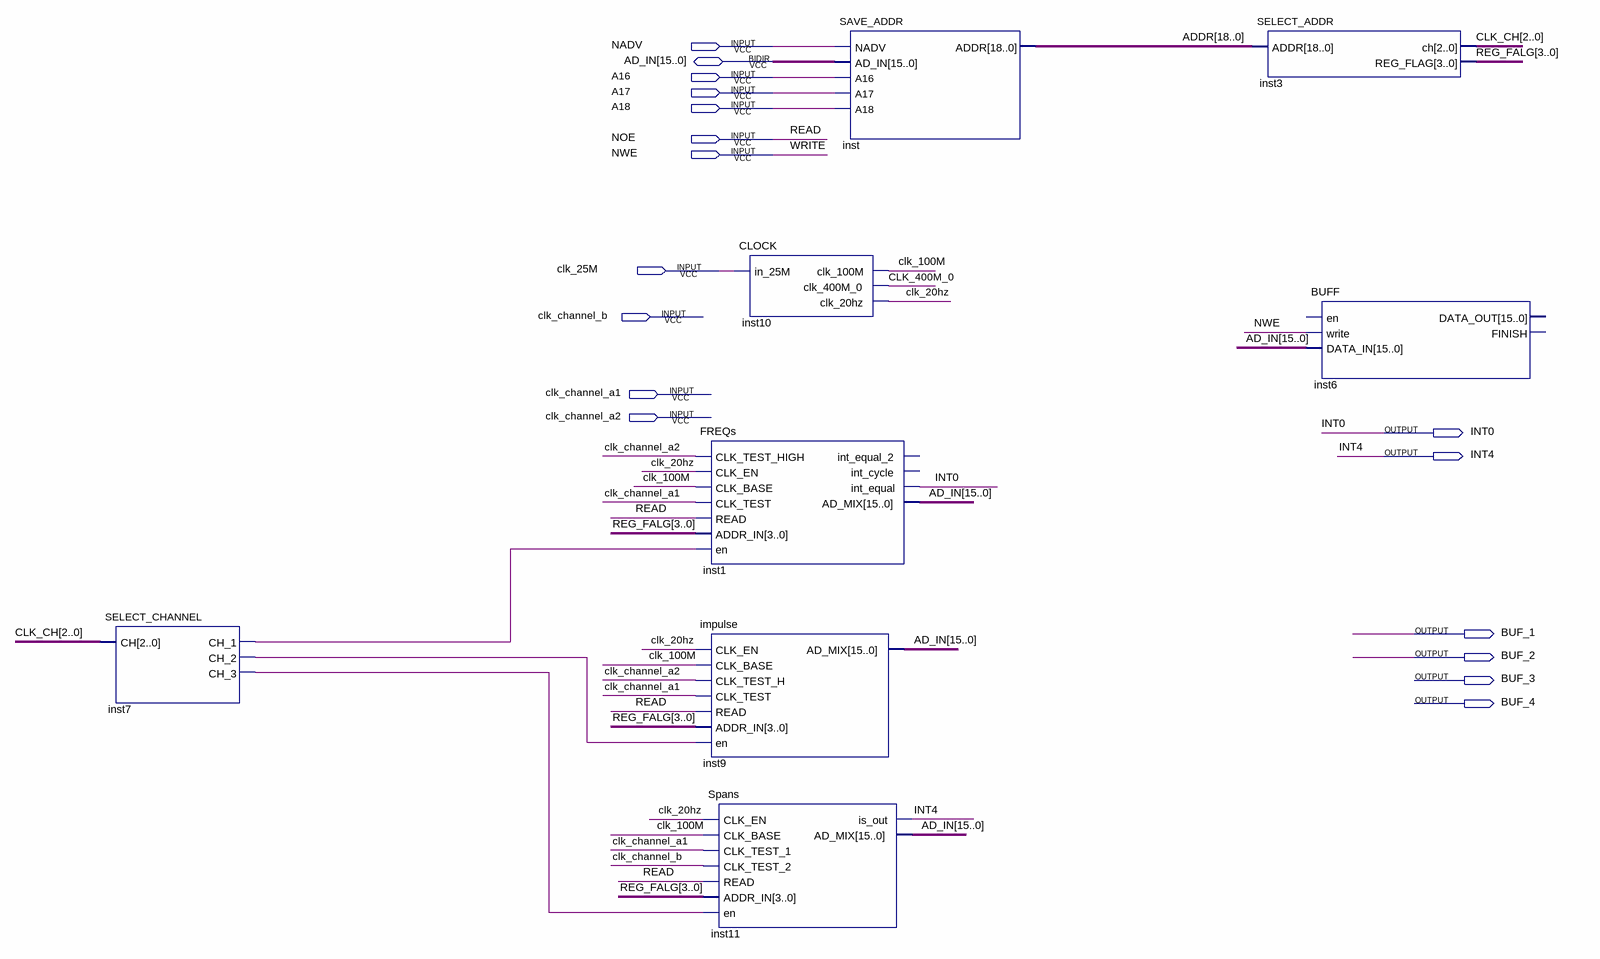
[diagram p0: schematic sheet]
// Quartus schematic FPGA_EP2C.bdf as structural Verilog: 8 symbols, 17 pins
module FPGA_EP2C (
  input  NADV,
  input  A16,
  input  A17,
  input  A18,
  input  NOE,
  input  NWE,
  input  clk_25M,
  input  clk_channel_b,
  input  clk_channel_a1,
  input  clk_channel_a2,
  inout  [15:0] AD_IN,
  output INT0,
  output INT4,
  output BUF_1,
  output BUF_2,
  output BUF_3,
  output BUF_4
);

  wire clk_20hz, clk_100M, CLK_400M_0, inst7_ch_1, inst7_ch_2, inst7_ch_3;
  wire [2:0] CLK_CH;
  wire [3:0] REG_FALG;
  wire [18:0] ADDR;

  SELECT_CHANNEL inst7 (.CH(CLK_CH), .CH_1(inst7_ch_1), .CH_2(inst7_ch_2), .CH_3(inst7_ch_3));
  FREQs inst1 (
    .CLK_TEST_HIGH(clk_channel_a2), .CLK_EN(clk_20hz), .CLK_BASE(clk_100M), .CLK_TEST(clk_channel_a1),
    .READ(NOE), .ADDR_IN(REG_FALG), .en(inst7_ch_1), .int_equal(INT0), .AD_MIX(AD_IN));  // open: int_equal_2, int_cycle
  impulse inst9 (
    .CLK_EN(clk_20hz), .CLK_BASE(clk_100M), .CLK_TEST_H(clk_channel_a2), .CLK_TEST(clk_channel_a1),
    .READ(NOE), .ADDR_IN(REG_FALG), .en(inst7_ch_2), .AD_MIX(AD_IN));
  Spans inst11 (
    .CLK_EN(clk_20hz), .CLK_BASE(clk_100M), .CLK_TEST_1(clk_channel_a1), .CLK_TEST_2(clk_channel_b),
    .READ(NOE), .ADDR_IN(REG_FALG), .en(inst7_ch_3), .is_out(INT4), .AD_MIX(AD_IN));
  CLOCK inst10 (.in_25M(clk_25M), .clk_100M(clk_100M), .clk_400M_0(CLK_400M_0), .clk_20hz(clk_20hz));
  SAVE_ADDR inst (.NADV(NADV), .AD_IN(AD_IN), .A16(A16), .A17(A17), .A18(A18), .ADDR(ADDR));
  SELECT_ADDR inst3 (.ADDR(ADDR), .ch(CLK_CH), .REG_FLAG(REG_FALG));
  BUFF inst6 (.write(NWE), .DATA_IN(AD_IN));  // open: en, DATA_OUT, FINISH

  // Other names for the same wires on the sheet: READ = NOE; WRITE = NWE
endmodule
